# Altium project LM-CT32-001.PrjPcb
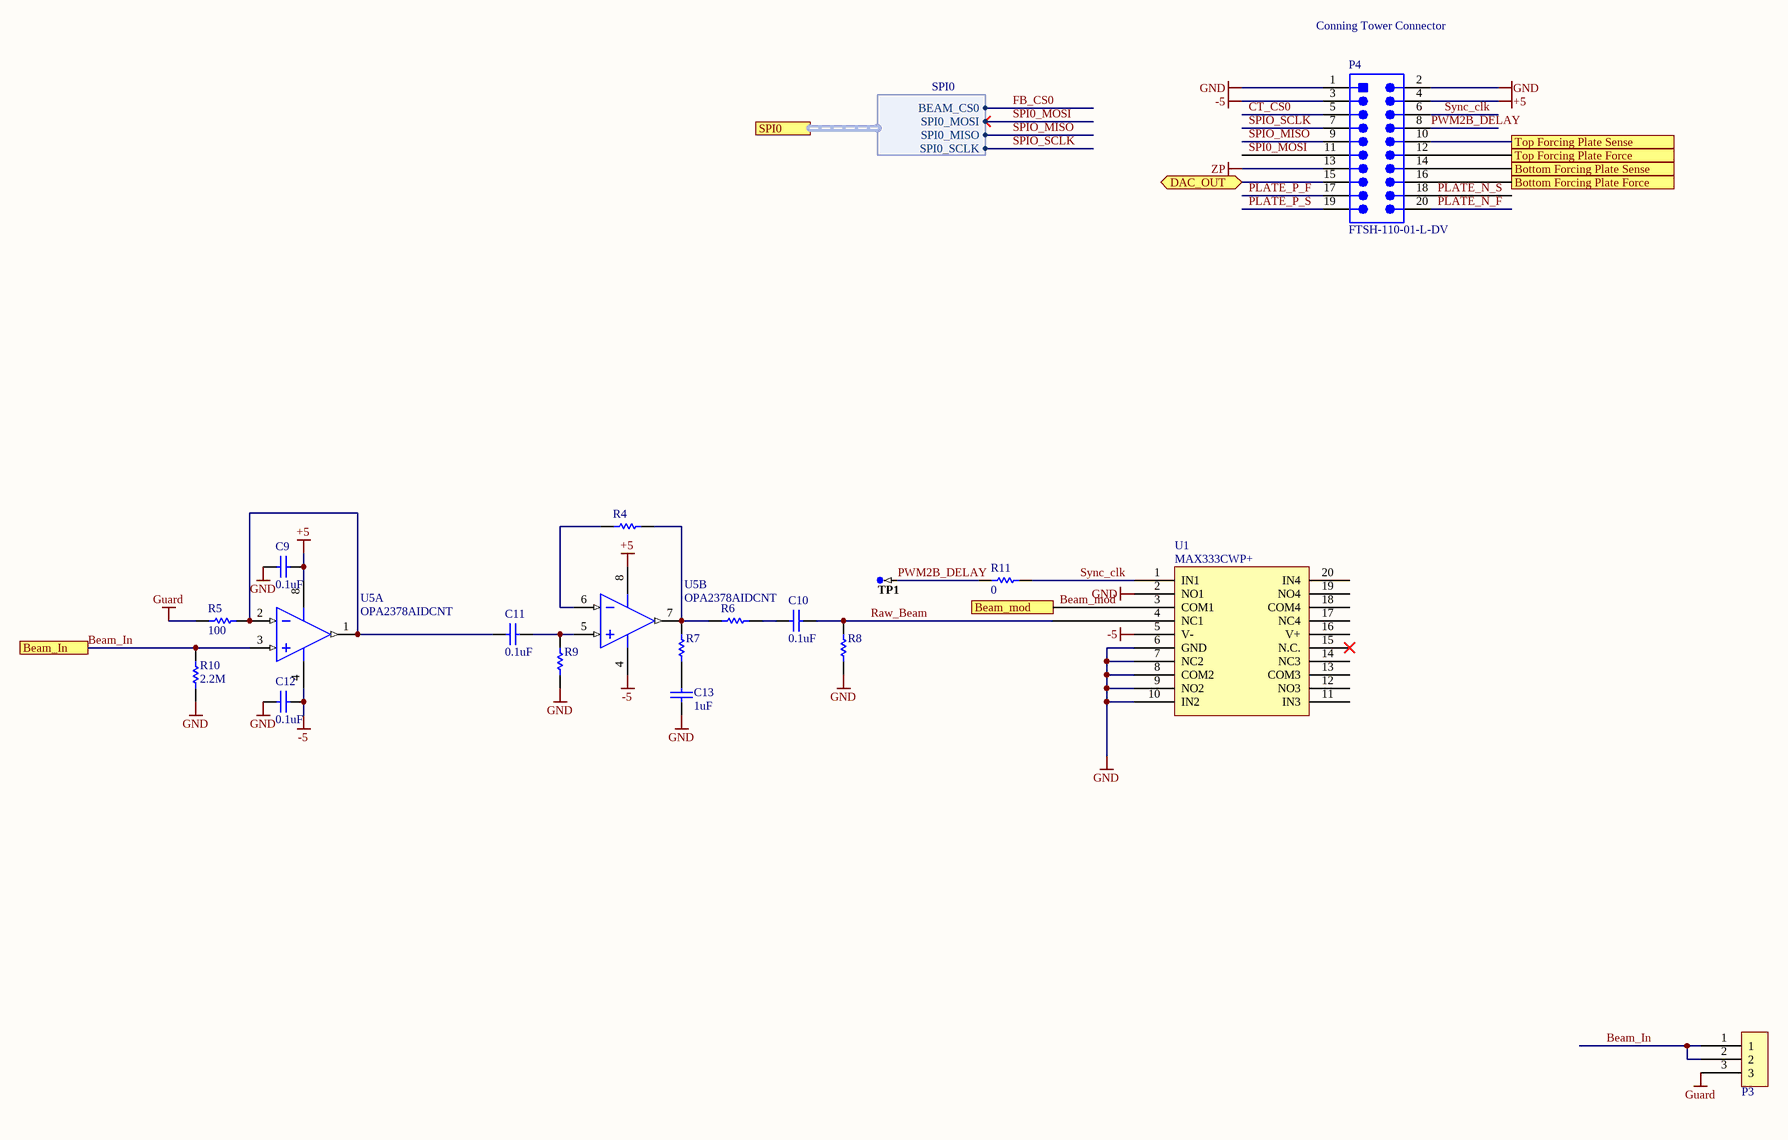
[diagram p0: Beam_Amp.SchDoc]
4 sheets, 62 parts. Net scope: flat (ports and power ports of the same name join across sheets).
Board file: LM-CT-001.PcbDoc
Sheets:
  Beam_Amp.SchDoc
  ADC.SchDoc
  Sense.SchDoc
  Force.SchDoc

## Sheet Beam_Amp.SchDoc
size Tabloid

### Parts
(Parts that share a designator on the sheet are numbered #1, #2 ... from top to bottom, then left to right.)
C9  0.1uF  [CAPC0402(1005)60_L]
C10  0.1uF  [CAPC0402(1005)60_L]
C11  0.1uF  [CAPC0402(1005)60_L]
C12  0.1uF  [CAPC0402(1005)60_L]
C13  1uF  [CAPC0402(1005)60_L]
P3  Triax_Conn  [Triax_Conn]  (value not drawn)
P4  FTSH-110-01-L-DV  [SMTC-FTSH-110-01-L-DV_V]
R4  (no value)  [RESC0402(1005)_M]
R5  100  [RESC0402(1005)_M]
R6  (no value)  [RESC0402(1005)_M]
R7  (no value)  [RESC0402(1005)_M]
R8  (no value)  [RESC0402(1005)_M]
R9  (no value)  [RESC0402(1005)_M]
R10  2.2M  [RESC0402(1005)_M]
R11#1  0  [RESC0805(2012)_L]
TP1  TP-SM-C-100  [TP-SM-C-100]  (value not drawn)  (no BOM)
U1  MAX333CWP+  [TSOP65P640X90-20N]
U5  OPA2378AIDCNT  [DCN0008A_M]  (parts A,B of 2)

### Ports
Beam_In, Beam_mod, Bottom Forcing Plate Force, Bottom Forcing Plate Sense, DAC_OUT, SPI0 (harness SPI0), Top Forcing Plate Force, Top Forcing Plate Sense

### Harnesses
SPI0: BEAM_CS0, SPI0_MOSI, SPI0_MISO, SPI0_SCLK

### Nets
+5: C9.2 P4.4 U5.8(V+)
-5: C12.2 P4.3 U1.5(V-) U5.4(V-)
GND: C9.1 C12.1 C13.1 P4.1 P4.2 R8.2 R9.2 R10.1 U1.2(NO1) U1.6(GND) U1.7(NC2) U1.8(COM2) U1.9(NO2) U1.10(IN2)
Guard: P3.3 R5.2
ZP: P4.13
Beam_In: P3.1 P3.2 R10.2 U5.3(IN_A+) ; port Beam_In
Beam_mod: U1.3(COM1) ; port Beam_mod
CT_CS0: P4.5
DAC_OUT: P4.15 ; port DAC_OUT
PLATE_N_F: P4.20
PLATE_N_S: P4.18
PLATE_P_F: P4.17
PLATE_P_S: P4.19
PWM2B_DELAY: P4.8 R11#1.1 TP1.1
Raw_Beam: C10.2 R8.1 U1.4(NC1)
SPI0_MOSI: P4.11 ; port SPI0.SPI0_MOSI
SPIO_MISO: P4.9 ; port SPI0.SPI0_MISO
SPIO_SCLK: P4.7 ; port SPI0.SPI0_SCLK
Sync_clk: P4.6 R11#1.2 U1.1(IN1)
NetC10_1: C10.1 R6.1
NetC11_1: C11.1 R5.1 U5.1(OUT_A) U5.2(IN_A-)
NetC11_2: C11.2 R9.1 U5.5(IN_B+)
NetC13_2: C13.2 R7.2
NetP4_10: P4.10 ; port Top Forcing Plate Sense
NetP4_12: P4.12 ; port Top Forcing Plate Force
NetP4_14: P4.14 ; port Bottom Forcing Plate Sense
NetP4_16: P4.16 ; port Bottom Forcing Plate Force
NetR4_1: R4.1 R6.2 R7.1 U5.7(OUT_B)
NetR4_2: R4.2 U5.6(IN_B-)

Not connected (* = marked no-connect by the designer): U1 11(IN3) 12(NO3) 13(COM3) 14(NC3) 15(N.C.)* 16(V+) 17(NC4) 18(COM4) 19(NO4) 20(IN4)

### Notes on the sheet
- Conning Tower Connector
- Title
- Size:
- Date:
- Tabloid
- Number:
- Time:
- Revision:
- Sheet
- of
- ZLS Corporation
- 7801 North Lamar Blvd.
- Suite E-184
- Austin, Texas 78752  USA
- (512) 453-0288
- File:

### Library data of the parts
C9-C13 = CMP-1034-00252-1: CAP CER 0.1UF 10V X7R 0402; Manufacturer: Murata Electronics North America; Manufacturer Part Number: GRM155R71A104KA01D; Tolerance: ±10%; Supplier 1: Digi-Key; Supplier Part Number 1: 490-6321-1-ND; RoHS: RoHS Compliant; Category: Capacitors; Stock 1: 2920395; Pricing 1: 1=0.1, 10=0.014, 100=0.0063, 500=0.00446, 1000=0.00351, 2500=0.00319, 5000=0.00293 (USD); Packaging: Cut Tape (CT); Part Status: Active; Voltage - Rated: 10V; Temperature Coefficient: X7R; Operating Temperature: -55°C ~ 125°C; Features: -; Ratings: -; Applications: General Purpose; Mounting Type: Surface Mount, MLCC; Package / Case: 0402 (1005 Metric); Size / Dimension: 0.039" L x 0.020" W (1.00mm x 0.50mm); Height - Seated (Max): -; Thickness (Max): 0.022" (0.55mm); Lead Spacing: -; ComponentLink1URL: http://www.murata.com/~/media/webrenewal/support/library/catalog/products/capacitor/mlcc/c02e.ashx?la=en-us; ComponentLink1Description: http://www.murata.com/~/media/webrenewal/support/library/catalog/products/capacitor/mlcc/c02e.ashx?la=en-us
P4 = CMP-2000-06294-2: Male Header, Pitch 1.27 mm, 2 x 10 Position, Height 6.1 mm, -55 to 125 degC, RoHS, Tube; Manufacturer: Samtec; Online Catalog: FTSHSeries; Number of Positions Loaded: All; Connector Type: Header,Unshrouded; Product Training Modules: Board-to-BoardConnectors; Featured Product: Board-To-BoardInterconnectSystems; Other Names: SAM1161-10; EDA / CAD Models: DownloadfromAcceleratedDesigns; Number of Positions: 20; Catalog Drawings: FTSHSeriesFTSHSeriesSMTSide; Package Reference: FTSH-110-01-L-DV; Family: RectangularConnectors-Headers,MalePins; Mounting Technology: SurfaceMount; Contact Type: MalePin; Manufacturer URL: http://www.samtec.com/; Package URL: http://suddendocs.samtec.com/prints/ftsh-1xx-xx-xxx-dv-xxx-xxx-mkt.pdf; Package Description: Male Header, Pitch 1.27 mm, 2 x 10 Position, Height 6.1 mm; Packaging: Bulk; Termination: Solder; Category: Connectors,Interconnects; Fastening Type: -; Datasheet Version: F-215 , 02/2016; Contact Finish Thickness: 10µin(0.25µm); Number of Rows: 2; Datasheet URL: http://suddendocs.samtec.com/catalog_english/ftsh_smt.pdf; Mounting Type: SurfaceMount; Series: FTSH; Features: -; Contact Finish: Gold; Standard Package: 1; Color: Black
R4-R10 = CMP-1011-00463-1
R11#1 = CMP-1013-00215-1: RES SMD 0 OHM JUMPER 1/8W 0805; Manufacturer: Panasonic Electronic Components; Manufacturer Part Number: ERJ-6GEY0R00V; Power (Watts): 0.125W, 1/8W; Supplier 1: Digi-Key; Supplier Part Number 1: P0.0ACT-ND; RoHS: RoHS Compliant; Category: Resistors; Stock 1: 3414819; Pricing 1: 1=0.1, 10=0.074, 25=0.0532, 50=0.0406, 100=0.03, 250=0.02288, 500=0.0183, 1000=0.01347 (USD); Packaging: Cut Tape (CT); Part Status: Active; Tolerance: Jumper; Composition: Thick Film; Features: Automotive AEC-Q200; Temperature Coefficient: -; Operating Temperature: -55°C ~ 155°C; Package / Case: 0805 (2012 Metric); Supplier Device Package: 0805; Size / Dimension: 0.079" L x 0.049" W (2.00mm x 1.25mm); Height - Seated (Max): 0.028" (0.70mm); Failure Rate: -; ComponentLink1URL: http://industrial.panasonic.com/www-cgi/jvcr13pz.cgi?E+PZ+3+AOA0001+ERJ6GEY0R00V+7+WW; ComponentLink1Description: http://industrial.panasonic.com/www-cgi/jvcr13pz.cgi?E+PZ+3+AOA0001+ERJ6GEY0R00V+7+WW
TP1 = CMP-0484-00002-2: Test Point, Surface Mount, Circular, Pad Diameter 1 mm; Manufacturer: No Vendor; PartNumber: TP-SM-C-100
U1 = MAX333CWP+: IC SWITCH QUAD SPDT 20TSSOP; Manufacturer: Maxim; Manufacturer Part Number: MAX333AEUP+; Max Supply Voltage: 30V; Min Supply Voltage: 10V; Min Dual Supply Voltage: 4.5V; Max Dual Supply Voltage: 20V; On-State Resistance: 35R; Operating Supply Current: 1uA; Supply Type: Single,Dual; Max Power Dissipation: 559mW; Turn-On Delay Time: 175ns; Turn-Off Delay Time: 145ns; Max Supply Current: 250uA; Number of Bits: 4; Dual Supply Voltage: 15V; Supplier 1: Mouser; Supplier Part Number 1: 700-MAX333AEUP; Stock 1: 664; Pricing 1: 1=6.77, 10=6.43, 50=5.8, 100=5.8, 1000=5.62, 10000=5.62 (USD); Case/Package: TSSOP; Number of Pins: 20; Weight: 0.006737oz; Min Operating Temperature: -40°C; Max Operating Temperature: 85°C; Packaging: Rail/Tube; Package Quantity: 74; Throw Configuration: SPDT; Number of Channels: 4; Length: 6.6mm; Height: 0.95mm; Width: 4.5mm; Radiation Hardening: No; Lead Free: Lead Free; REACH SVHC: Unknown; ComponentLink1URL: https://datasheet.ciiva.com/2978/max333a-2978850.pdf; ComponentLink1Description: https://datasheet.ciiva.com/2978/max333a-2978850.pdf; ComponentLink2URL: https://datasheet.ciiva.com/30478/0900766b81253c85-30478260.pdf; ComponentLink2Description: https://datasheet.ciiva.com/30478/0900766b81253c85-30478260.pdf; ComponentLink3URL: https://datasheet.ciiva.com/1674/max333a-1674617.pdf; ComponentLink3Description: https://datasheet.ciiva.com/1674/max333a-1674617.pdf; ComponentLink4URL: https://datasheet.ciiva.com/26825/max333aeup-26825546.pdf; ComponentLink4Description: https://datasheet.ciiva.com/26825/max333aeup-26825546.pdf
U5 = CMP-0272-01124-3: Low-Noise, 900 kHz, RRIO, Precision Operational Amplifier, Zero-Drift Series, 2.2 to 5.5 V, -40 to 125 degC, 8-pin SOP (DCN8), Green (RoHS & no Sb/Br); Manufacturer: Texas Instruments; Number of Channels: 2; Offset Drift(Typ)(uV/C): 0.25; Total Supply Voltage(Min)(+5V is 5, +/-5V is 10): 2.2; Vn at 1kHz(Typ)(nV/rtHz): 20; Iq per channel(Max)(mA): 0.15; Total Supply Voltage(Max)(+5V is 5, +/-5V is 10): 5.5; Sub Family: Low Offset Voltage Amplifier (<=500uV), Low Power Amp (<=500uA), Low Supply Voltage Amplifier (<=2.7V), Precision Amplifier, Zero Drift Precision Amplifier; IIB(Max)(pA): 550; Vio (25C)(Max)(mV): 0.07; CMRR(Min)(dB): 100; Slew Rate(Typ)(V/us): 0.4; PartNumber: OPA2378AIDCNT; DatasheetVersion: SBOS417D; ComponentLink2Description: Datasheet; ComponentLink3URL: http://www.ti.com/lit/ml/mpds099c/mpds099c.pdf; ComponentLink2URL: http://www.ti.com/general/docs/lit/getliterature.tsp?genericPartNumber=OPA2378&fileType=pdf; PackageReference: DCN0008A; PackageDescription: 8-Pin Plastic Small Outline, Body 1.6 x 2.9 mm, Pitch 0.65 mm; Code_JEDEC: MO-178; PackageVersion: 4202106/D, 11/2009; ComponentLink3Description: Package Specification; Eco-Plan: Green (RoHS & no Sb/Br); ComponentLink1Description: Manufacturer URL; Mounting Technology: Surface Mount; ComponentLink1URL: http://www.ti.com/; PartId: 1

## Sheet ADC.SchDoc
size OrCAD A
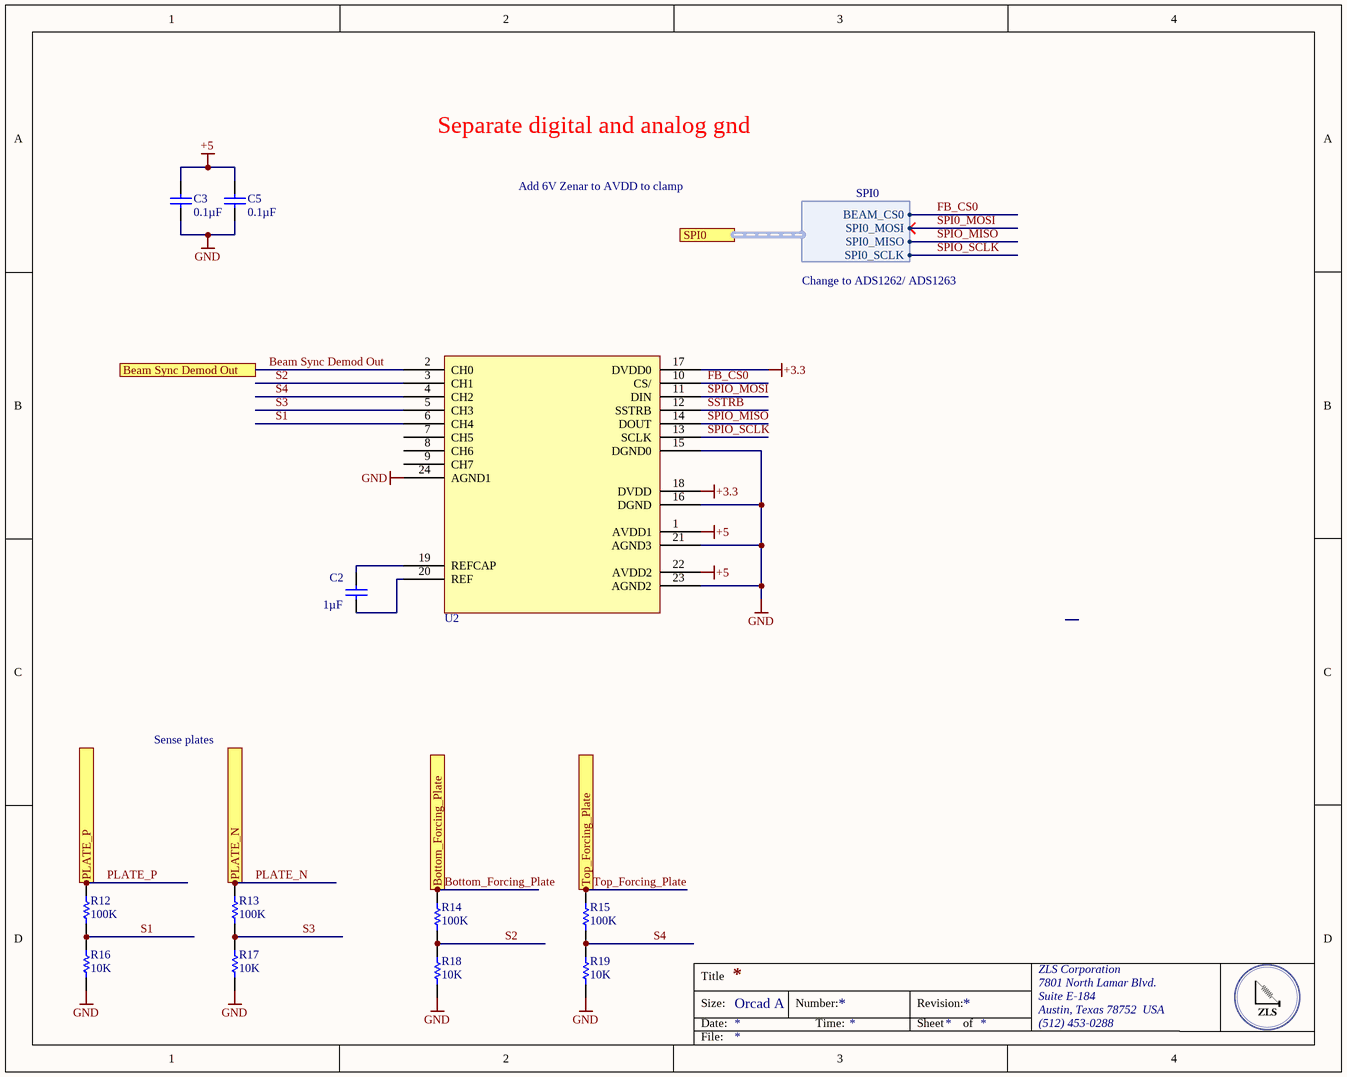
[diagram p1: ADC.SchDoc]

### Parts
(Parts that share a designator on the sheet are numbered #1, #2 ... from top to bottom, then left to right.)
C2#1  Capacitance: 1µF  [CAPC0805(2012)145_N]  (hidden comment: CAP CER 0.1UF 25V X7R 0805)
C3  Capacitance: 0.1µF  [CAPC0805(2012)145_N]  (hidden comment: CAP CER 0.1UF 25V X7R 0805)
C5  Capacitance: 0.1µF  [CAPC0805(2012)145_N]  (hidden comment: CAP CER 0.1UF 25V X7R 0805)
R12#1  100K  [RESC0402(1005)_M]
R13#1  100K  [RESC0402(1005)_M]
R14#1  100K  [RESC0402(1005)_M]
R15#1  100K  [RESC0402(1005)_M]
R16#1  10K  [RESC0402(1005)_M]
R17#1  10K  [RESC0402(1005)_M]
R18#1  10K  [RESC0402(1005)_M]
R19#1  10K  [RESC0402(1005)_M]
U2  MAX1300  [MAX1300]  (value not drawn)

### Ports
Beam Sync Demod Out, Bottom_Forcing_Plate, PLATE_N, PLATE_P, SPI0 (harness SPI0), Top_Forcing_Plate

### Harnesses
SPI0: BEAM_CS0, SPI0_MOSI, SPI0_MISO, SPI0_SCLK

### Nets
+3.3: U2.17(DVDD0) U2.18(DVDD)
+5: C3.2 C5.2 U2.1(AVDD1) U2.22(AVDD2)
GND: C3.1 C5.1 R16#1.1 R17#1.1 R18#1.1 R19#1.1 U2.15(DGND0) U2.16(DGND) U2.21(AGND3) U2.23(AGND2) U2.24(AGND1)
Beam Sync Demod Out: U2.2(CH0) ; port Beam Sync Demod Out
Bottom_Forcing_Plate: R14#1.2 ; port Bottom_Forcing_Plate  [project net Bottom Forcing Plate Sense]
FB_CS0: U2.10(CS/) ; port SPI0.BEAM_CS0
PLATE_N: R13#1.2 ; port PLATE_N
PLATE_P: R12#1.2 ; port PLATE_P
S1: R12#1.1 R16#1.2 U2.6(CH4)
S2: R14#1.1 R18#1.2 U2.3(CH1)
S3: R13#1.1 R17#1.2 U2.5(CH3)
S4: R15#1.1 R19#1.2 U2.4(CH2)
SPIO_MISO: U2.14(DOUT) ; port SPI0.SPI0_MISO
SPIO_MOSI: U2.11(DIN)
SPIO_SCLK: U2.13(SCLK) ; port SPI0.SPI0_SCLK
SSTRB: U2.12(SSTRB)
Top_Forcing_Plate: R15#1.2 ; port Top_Forcing_Plate  [project net Top Forcing Plate Sense]
NetC2#1_1: C2#1.1 U2.19(REFCAP)
NetC2#1_2: C2#1.2 U2.20(REF)

Not connected (* = marked no-connect by the designer): U2 7(CH5) 8(CH6) 9(CH7)

### Notes on the sheet
- Separate digital and analog gnd
- Add 6V Zenar to AVDD to clamp
- Change to ADS1262/ ADS1263
- Sense plates
- Title
- Size:
- Date:
- Orcad A
- Number:
- Time:
- Revision:
- Sheet
- of
- ZLS Corporation
- 7801 North Lamar Blvd.
- Suite E-184
- Austin, Texas 78752  USA
- (512) 453-0288
- File:

### Library data of the parts
C2#1 C3 C5 = CMP-1036-04795-1: Manufacturer: Murata Electronics North America; Manufacturer Part Number: GRM21BR71E104KA01L; Tolerance: ±10%; Supplier 1: Digi-Key; Supplier Part Number 1: 490-1673-6-ND; RoHS: RoHS Compliant; Category: Capacitors; Stock 1: 891652; Pricing 1: 1=0.2, 10=0.145, 100=0.0683, 500=0.04788, 1000=0.03964 (USD); Packaging: Digi-Reel®; Part Status: Active; Voltage - Rated: 25V; Temperature Coefficient: X7R; Operating Temperature: -55°C ~ 125°C; Features: -; Ratings: -; Applications: General Purpose; Mounting Type: Surface Mount, MLCC; Package / Case: 0805 (2012 Metric); Size / Dimension: 0.079" L x 0.049" W (2.00mm x 1.25mm); Height - Seated (Max): -; Thickness (Max): 0.053" (1.35mm); Lead Spacing: -; Lead Style: -; ComponentLink1URL: http://www.murata.com/~/media/webrenewal/support/library/catalog/products/capacitor/mlcc/c02e.ashx; ComponentLink1Description: http://www.murata.com/~/media/webrenewal/support/library/catalog/products/capacitor/mlcc/c02e.ashx
R12#1 R13#1 R14#1 R15#1 R16#1 R17#1 R18#1 R19#1 = CMP-1011-00463-1

## Sheet Sense.SchDoc
size OrCAD A
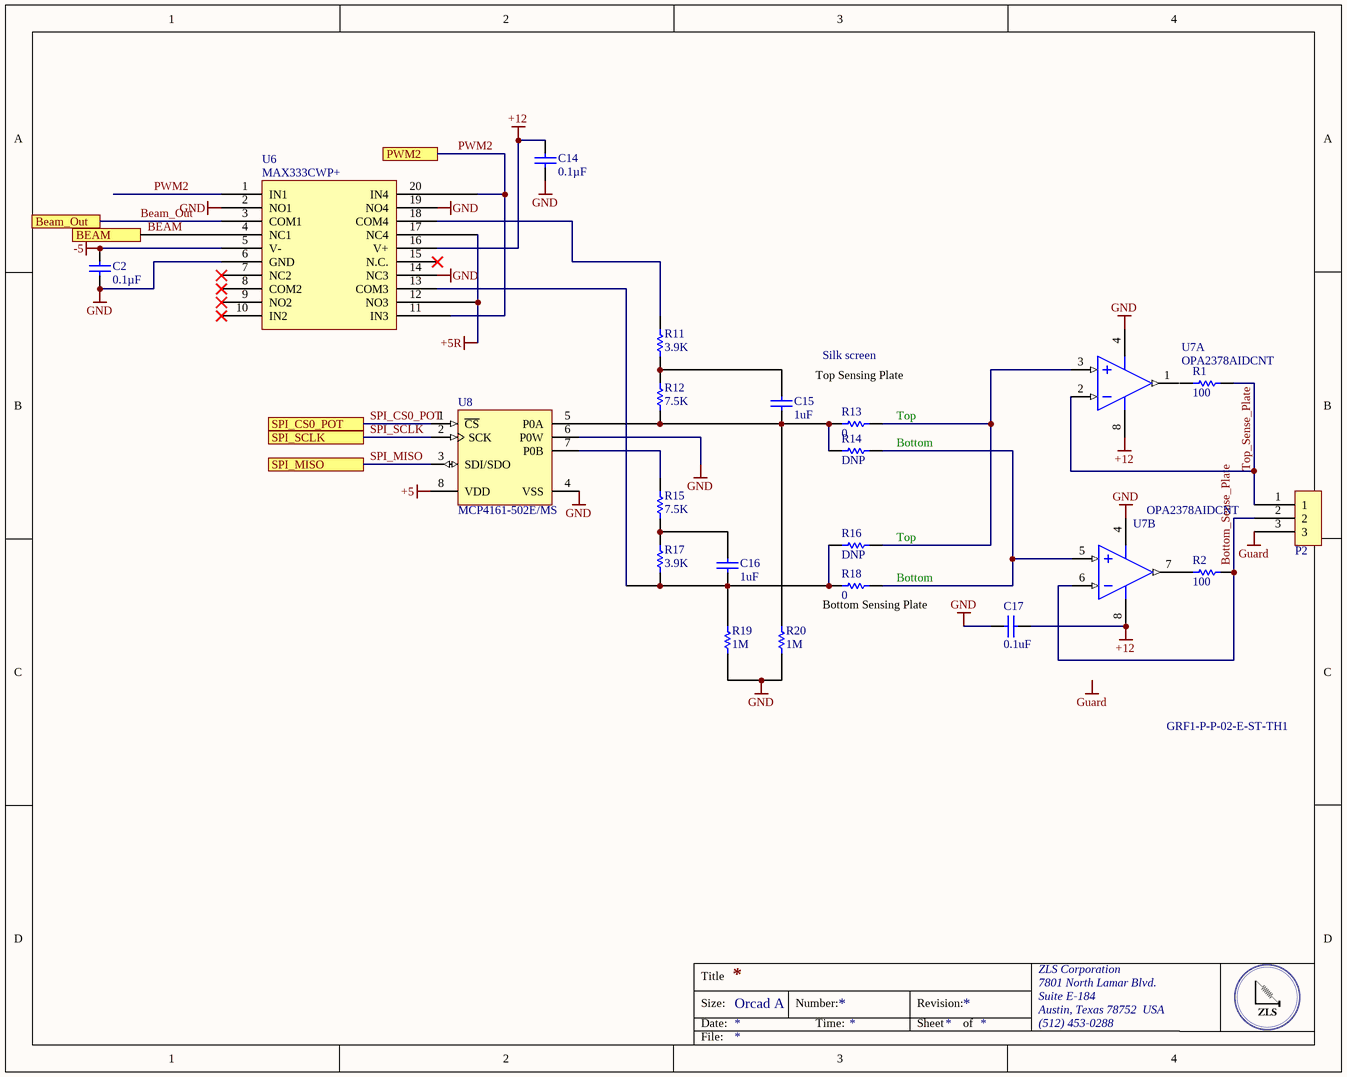
[diagram p2: Sense.SchDoc]

### Parts
(Parts that share a designator on the sheet are numbered #1, #2 ... from top to bottom, then left to right.)
C2#2  Capacitance: 0.1µF  [CAPC0805(2012)145_N]  (hidden comment: CAP CER 0.1UF 25V X7R 0805)
C14  Capacitance: 0.1µF  [CAPC0805(2012)145_N]  (hidden comment: CAP CER 0.1UF 25V X7R 0805)
C15  1uF  [CAPC0603(1608)100_L]
C16  1uF  [CAPC0603(1608)100_L]
C17  0.1uF  [CAPC0402(1005)60_L]
P2  Triax_Conn  [Triax_Conn]  (value not drawn)
R1  100  [RESC0402(1005)_M]
R2  100  [RESC0402(1005)_M]
R11#2  3.9K  [RESC0402(1005)_M]
R12#2  7.5K  [RESC0402(1005)_M]
R13#2  0  [RESC0402(1005)_M]
R14#2  DNP  [RESC0402(1005)_M]
R15#2  7.5K  [RESC0402(1005)_M]
R16#2  DNP  [RESC0402(1005)_M]
R17#2  3.9K  [RESC0402(1005)_M]
R18#2  0  [RESC0402(1005)_M]
R19#2  1M  [RESC0402(1005)_M]
R20  1M  [RESC0402(1005)_M]
U6  MAX333CWP+  [TSOP65P640X90-20N]
U7  OPA2378AIDCNT  [DCN0008A_M]  (parts A,B of 2)
U8  MCP4161-502E/MS  [MSOP-MS8_N]

### Ports
BEAM, Beam_Out, PWM2, SPI_CS0_POT, SPI_MISO, SPI_SCLK

### Nets
+5: U8.8(VDD)
+5R: U6.12(NO3) U6.17(NC4)
+12: C14.2 C17.2 U6.16(V+) U7.8(V+)
-5: C2#2.1 U6.5(V-)
GND: C2#2.2 C14.1 C17.1 R19#2.1 R20.1 U6.2(NO1) U6.6(GND) U6.14(NC3) U6.19(NO4) U7.4(V-) U8.4(VSS) U8.6(P0W)
Guard: P2.3
BEAM: U6.4(NC1) ; port BEAM
Beam_Out: U6.3(COM1) ; port Beam_Out
Bottom_Sense_Plate: P2.2 R2.1 U7.6(IN_B-)
PWM2: U6.1(IN1) U6.11(IN3) U6.20(IN4) ; port PWM2
SPI_CS0_POT: U8.1(~{CS}) ; port SPI_CS0_POT
SPI_MISO: U8.3(SDI/SDO) ; port SPI_MISO
SPI_SCLK: U8.2(SCK) ; port SPI_SCLK
Top_Sense_Plate: P2.1 R1.1 U7.2(IN_A-)
NetC15_1: C15.1 R12#2.1 R13#2.2 R14#2.2 R20.2 U8.5(P0A)
NetC15_2: C15.2 R11#2.1 R12#2.2
NetC16_1: C16.1 R16#2.2 R17#2.1 R18#2.2 R19#2.2 U6.13(COM3)
NetC16_2: C16.2 R15#2.1 R17#2.2
NetR2_2: R2.2 U7.7(OUT_B)
NetR11#2_2: R11#2.2 U6.18(COM4)
NetR13#2_1: R13#2.1 R16#2.1 U7.3(IN_A+)
NetR14#2_1: R14#2.1 R18#2.1 U7.5(IN_B+)
NetR15#2_2: R15#2.2 U8.7(P0B)

Not connected (* = marked no-connect by the designer): R1 2; U6 7(NC2)* 8(COM2)* 9(NO2)* 10(IN2)* 15(N.C.)*; U7 1(OUT_A)

### Notes on the sheet
- Top Sensing Plate
- Silk screen
- Top
- Bottom
- (near R16#2) Top
- (near R18#2) Bottom Sensing Plate
- GRF1-P-P-02-E-ST-TH1
- Labels drawn without touching a wire or pin: Guard
- Title
- Size:
- Date:
- Orcad A
- Number:
- Time:
- Revision:
- Sheet
- of
- ZLS Corporation
- 7801 North Lamar Blvd.
- Suite E-184
- Austin, Texas 78752  USA
- (512) 453-0288
- File:

### Library data of the parts
C2#2 C14 = CMP-1036-04795-1: as C2#1 on sheet ADC; Supplier 1: Digi-Key; Supplier Part Number 1: 490-1673-6-ND; RoHS: RoHS Compliant; Category: Capacitors; Stock 1: 891652; Pricing 1: 1=0.2, 10=0.145, 100=0.0683, 500=0.04788, 1000=0.03964 (USD); Packaging: Digi-Reel®; Part Status: Active; Voltage - Rated: 25V; Temperature Coefficient: X7R; Operating Temperature: -55°C ~ 125°C; Features: -; Ratings: -; Applications: General Purpose; Mounting Type: Surface Mount, MLCC; Package / Case: 0805 (2012 Metric); Size / Dimension: 0.079" L x 0.049" W (2.00mm x 1.25mm); Height - Seated (Max): -; Thickness (Max): 0.053" (1.35mm); Lead Spacing: -; Lead Style: -; ComponentLink1URL: http://www.murata.com/~/media/webrenewal/support/library/catalog/products/capacitor/mlcc/c02e.ashx; ComponentLink1Description: http://www.murata.com/~/media/webrenewal/support/library/catalog/products/capacitor/mlcc/c02e.ashx
C15 C16 = CMP-1035-00303-1: CAP 4.3pF 25V ±0.5pF 0603 (1608 Metric) Thickness 1mm SMD; Manufacturer: Samsung Electro-Mechanics; Manufacturer Part Number: CL10B105KA8NNNC; Tolerance: ±10%; Temperature Coefficient: X7R; Notification: Current market demand for these product types have resulted in fluctuating and extending lead times. Lead times may differ.; Supplier 1: Digi-Key; Supplier Part Number 1: 1276-1184-1-ND; RoHS: RoHS Compliant; Category: Capacitors; Stock 1: 1067488; Pricing 1: 1=0.1, 10=0.061, 100=0.027, 500=0.01926, 1000=0.01513 (USD); Packaging: Cut Tape (CT); Part Status: Active; Voltage - Rated: 25V; Operating Temperature: -55°C ~ 125°C; Features: -; Ratings: -; Applications: General Purpose; Mounting Type: Surface Mount, MLCC; Package / Case: 0603 (1608 Metric); Size / Dimension: 0.063" L x 0.032" W (1.60mm x 0.80mm); Height - Seated (Max): -; Thickness (Max): 0.035" (0.90mm); Lead Spacing: -; Lead Style: -; ComponentLink1URL: http://media.digikey.com/pdf/Data%20Sheets/Samsung%20PDFs/CL_Series_MLCC_ds.pdf; ComponentLink1Description: http://media.digikey.com/pdf/Data%20Sheets/Samsung%20PDFs/CL_Series_MLCC_ds.pdf
C17 = CMP-1034-00252-1: as C9 on sheet Beam_Amp; Supplier 1: Digi-Key; Supplier Part Number 1: 490-6321-1-ND; RoHS: RoHS Compliant; Category: Capacitors; Stock 1: 2920395; Pricing 1: 1=0.1, 10=0.014, 100=0.0063, 500=0.00446, 1000=0.00351, 2500=0.00319, 5000=0.00293 (USD); Packaging: Cut Tape (CT); Part Status: Active; Voltage - Rated: 10V; Temperature Coefficient: X7R; Operating Temperature: -55°C ~ 125°C; Features: -; Ratings: -; Applications: General Purpose; Mounting Type: Surface Mount, MLCC; Package / Case: 0402 (1005 Metric); Size / Dimension: 0.039" L x 0.020" W (1.00mm x 0.50mm); Height - Seated (Max): -; Thickness (Max): 0.022" (0.55mm); Lead Spacing: -; ComponentLink1URL: http://www.murata.com/~/media/webrenewal/support/library/catalog/products/capacitor/mlcc/c02e.ashx?la=en-us; ComponentLink1Description: http://www.murata.com/~/media/webrenewal/support/library/catalog/products/capacitor/mlcc/c02e.ashx?la=en-us
R1 R2 R11#2 R12#2 R15#2 R17#2 R19#2 R20 = CMP-1011-00463-1
R13#2 R14#2 R16#2 R18#2 = CMP-1011-00651-1
U6 = MAX333CWP+: as U1 on sheet Beam_Amp; Supplier 1: Mouser; Supplier Part Number 1: 700-MAX333AEUP; Stock 1: 664; Pricing 1: 1=6.77, 10=6.43, 50=5.8, 100=5.8, 1000=5.62, 10000=5.62 (USD); Case/Package: TSSOP; Number of Pins: 20; Weight: 0.006737oz; Min Operating Temperature: -40°C; Max Operating Temperature: 85°C; Packaging: Rail/Tube; Package Quantity: 74; Throw Configuration: SPDT; Number of Channels: 4; Length: 6.6mm; Height: 0.95mm; Width: 4.5mm; Radiation Hardening: No; Lead Free: Lead Free; REACH SVHC: Unknown; ComponentLink1URL: https://datasheet.ciiva.com/2978/max333a-2978850.pdf; ComponentLink1Description: https://datasheet.ciiva.com/2978/max333a-2978850.pdf; ComponentLink2URL: https://datasheet.ciiva.com/30478/0900766b81253c85-30478260.pdf; ComponentLink2Description: https://datasheet.ciiva.com/30478/0900766b81253c85-30478260.pdf; ComponentLink3URL: https://datasheet.ciiva.com/1674/max333a-1674617.pdf; ComponentLink3Description: https://datasheet.ciiva.com/1674/max333a-1674617.pdf; ComponentLink4URL: https://datasheet.ciiva.com/26825/max333aeup-26825546.pdf; ComponentLink4Description: https://datasheet.ciiva.com/26825/max333aeup-26825546.pdf
U7 = CMP-0272-01124-3: as U5 on sheet Beam_Amp; PartNumber: OPA2378AIDCNT; DatasheetVersion: SBOS417D; ComponentLink2Description: Datasheet; ComponentLink3URL: http://www.ti.com/lit/ml/mpds099c/mpds099c.pdf; ComponentLink2URL: http://www.ti.com/general/docs/lit/getliterature.tsp?genericPartNumber=OPA2378&fileType=pdf; PackageReference: DCN0008A; PackageDescription: 8-Pin Plastic Small Outline, Body 1.6 x 2.9 mm, Pitch 0.65 mm; Code_JEDEC: MO-178; PackageVersion: 4202106/D, 11/2009; ComponentLink3Description: Package Specification; Eco-Plan: Green (RoHS & no Sb/Br); ComponentLink1Description: Manufacturer URL; Mounting Technology: Surface Mount; ComponentLink1URL: http://www.ti.com/; PartId: 1
U8 = CMP-0188-00907-2: 7/8-Bit Single/Dual SPI Digital POT with Non-Volatile Memory, 8-Pin MSOP, Extended Temperature; ComponentLink2Description: Datasheet; PackageDescription: 8-Lead Plastic Micro Small Outline Package (MS) [MSOP]; PackageVersion: revBB, Aug-2009; PackageReference: MSOP-MS8; ComponentLink1Description: Manufacturer URL; ComponentLink3URL: http://www.microchip.com/stellent/groups/techpub_sg/documents/packagingspec/en012702.pdf; DatasheetVersion: revB, Dec-2008; ComponentLink3Description: Package Specification; ComponentLink1URL: http://www.microchip.com/; RevisionNote: URLs added.; ComponentLink2URL: http://ww1.microchip.com/downloads/en/DeviceDoc/22059b.pdf

## Sheet Force.SchDoc
size Tabloid
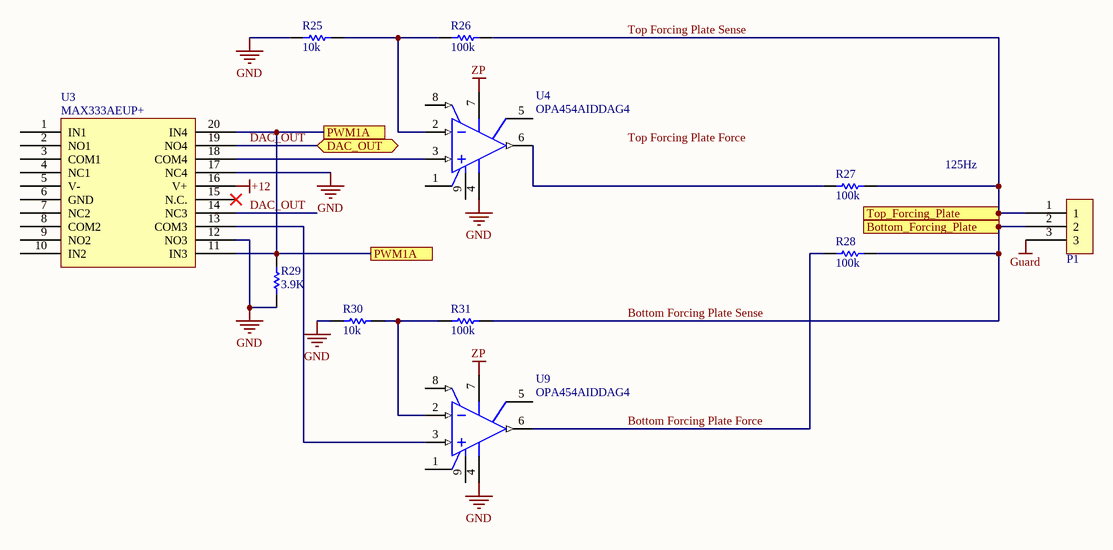
[diagram p3: Force.SchDoc]

### Parts
P1  Triax_Conn  [Triax_Conn]  (value not drawn)
R25  10k  [RESC0402(1005)_M]
R26  100k  [RESC0402(1005)_M]
R27  100k  [RESC0402(1005)_M]
R28  100k  [RESC0402(1005)_M]
R29  3.9K  [RESC0402(1005)_M]
R30  10k  [RESC0402(1005)_M]
R31  100k  [RESC0402(1005)_M]
U3  MAX333AEUP+  [TSOP65P640X90-20N]
U4  OPA454AIDDAG4  [TI-DDA8-2745X2245TP_N]
U9  OPA454AIDDAG4  [TI-DDA8-2745X2245TP_N]

### Ports
Bottom_Forcing_Plate, DAC_OUT, PWM1A, Top_Forcing_Plate

### Nets
+12: U3.16(V+)
GND: R25.1 R29.1 R30.1 U3.12(NO3) U3.17(NC4) U4.4(V-) U9.4(V-)
Guard: P1.3
ZP: U4.7(V+) U9.7(V+)
Bottom Forcing Plate Force: R28.2 U9.6(OUT)
Bottom Forcing Plate Sense: P1.2 R28.1 R31.2 ; port Bottom_Forcing_Plate
DAC_OUT: U3.14(NC3) U3.19(NO4) ; port DAC_OUT
Top Forcing Plate Sense: P1.1 R26.2 R27.1 ; port Top_Forcing_Plate
NetR25_2: R25.2 R26.1 U4.2(IN-)
NetR27_2: R27.2 U4.6(OUT)
NetR29_2: R29.2 U3.11(IN3) U3.20(IN4) ; port PWM1A
NetR30_2: R30.2 R31.1 U9.2(IN-)
NetU3_13: U3.13(COM3) U9.3(IN+)
NetU3_18: U3.18(COM4) U4.3(IN+)

Not connected (* = marked no-connect by the designer): U3 1(IN1) 2(NO1) 3(COM1) 4(NC1) 5(V-) 6(GND) 7(NC2) 8(COM2) 9(NO2) 10(IN2) 15(N.C.)*; U4 1(E/D_COM) 5(STATUS_FLAG) 8(E/D) 9(EP); U9 1(E/D_COM) 5(STATUS_FLAG) 8(E/D) 9(EP)

### Notes on the sheet
- 125Hz
- Labels drawn without touching a wire or pin: Top Forcing Plate Force
- Title
- Size:
- Date:
- Tabloid
- Number:
- Time:
- Revision:
- Sheet
- of
- ZLS Corporation
- 7801 North Lamar Blvd.
- Suite E-184
- Austin, Texas 78752  USA
- (512) 453-0288
- File:

### Library data of the parts
R25 R26 R29-R31 = CMP-1011-00463-1
R27 R28 = CMP-1011-00651-1
U3 = MAX333CWP+: IC SWITCH QUAD SPDT 20TSSOP; Manufacturer: Maxim Integrated; Multiplexer/Demultiplexer Circuit: 2:1; On-State Resistance (Max): 45 Ohm; Channel-to-Channel Matching (&Delta;Ron): 2 Ohm (Max); Voltage - Supply, Single (V+): 10 V ~ 30 V; Voltage - Supply, Dual (V±): ±4.5 V ~ 20 V; Switch Time (Ton, Toff) (Max): 175ns, 145ns; Charge Injection: 2pC; Channel Capacitance (CS(off), CD(off)): 5pF; Current - Leakage (IS(off)) (Max): 250pA; Crosstalk: -78dB @ 1MHz; Supplier 1: Digi-Key; Supplier Part Number 1: MAX333AEUP+-ND; Manufacturer Part Number: MAX333AEUP+; RoHS: RoHS Compliant; Category: Integrated Circuits (ICs); Stock 1: 1328; Pricing 1: 1=6.77, 10=6.432, 25=6, 50=5.8942 (USD); Packaging: Tube; Part Status: Active; Switch Circuit: SPDT; -3db Bandwidth: -; Operating Temperature: -40°C ~ 85°C (TA); Package / Case: 20-TSSOP (0.173", 4.40mm Width); Supplier Device Package: 20-TSSOP; Base Part Number: MAX333; ComponentLink1URL: https://pdfserv.maximintegrated.com/en/ds/MAX333A.pdf; ComponentLink1Description: https://pdfserv.maximintegrated.com/en/ds/MAX333A.pdf
U4 U9 = CMP-0017-00715-1: High Voltage (100V), High-Current (50mA) Operational Amplifier, G=1 Stable, 10 to 100 V, -55 to 125 degC, 8-pin SOP (DDA8), Green (RoHS & no Sb/Br); Manufacturer: Texas Instruments; Sub Family: General Purpose Amplifier, High Output Current Amplifier (>=50mA), High Supply Voltage Amplifier (>=30V), Precision Amplifier; Offset Drift(Typ)(uV/C): 1.6; Slew Rate(Typ)(V/us): 13; Number of Channels: 1; Total Supply Voltage(Max)(+5V is 5, +/-5V is 10): 100; Total Supply Voltage(Min)(+5V is 5, +/-5V is 10): 10; Vio (25C)(Max)(mV): 4; GBW(Typ)(MHz): 2.5; Vn at 1kHz(Typ)(nV/rtHz): 47; Rating: Catalog; ComponentLink1URL: http://www.ti.com/; PartNumber: OPA454AIDDAG4; ComponentLink1Description: Manufacturer URL; Eco-Plan: Green (RoHS & no Sb/Br); ComponentLink3URL: http://www.ti.com/litv/pdf/mpds092e; IIB(Max)(pA): 100; ComponentLink2URL: http://www.ti.com/lit/ds/symlink/opa454.pdf; ComponentLink3Description: Package Specification; DatasheetVersion: SBOS391A; Iq per channel(Max)(mA): 4; PackageVersion: 4202561/F, 12/2011; Code_JEDEC: MS-012; CMRR(Min)(dB): 100; PackageReference: DDA8-2745X2245TP; Mounting Technology: Surface Mount; ComponentLink2Description: Datasheet; PackageDescription: 8-Pin PowerPAD(TM) Plastic Small Outline, Body 3.9 x 4.9 mm, Pitch 1.27 mm

## Nets that join several sheets
+5: Beam_Amp (C9.2 P4.4 U5.8), ADC (C3.2 C5.2 U2.1 U2.22), Sense (U8.8)
+12: Sense (C14.2 C17.2 U6.16 U7.8), Force (U3.16)
-5: Beam_Amp (C12.2 P4.3 U1.5 U5.4), Sense (C2#2.1 U6.5)
GND: Beam_Amp (14 pins), ADC (11 pins), Sense (12 pins), Force (7 pins)
Guard: Beam_Amp (P3.3 R5.2), Sense (P2.3), Force (P1.3)
ZP: Beam_Amp (P4.13), Force (U4.7 U9.7)
Bottom Forcing Plate Sense: ADC (R14#1.2), Force (P1.2 R28.1 R31.2)
DAC_OUT: Beam_Amp (P4.15), Force (U3.14 U3.19)
SPIO_MISO: Beam_Amp (P4.9), ADC (U2.14)
SPIO_SCLK: Beam_Amp (P4.7), ADC (U2.13)
Top Forcing Plate Sense: ADC (R15#1.2), Force (P1.1 R26.2 R27.1)